# Altium schematic sheet Sheet_ConnectA10.SchDoc: Sheet_ConnectA10
size A4; Organization: Altium Limited; Address1: L3, 12a Rodborough Rd; Address2: Frenchs Forest; Address3: NSW; Address4: Australia 2086
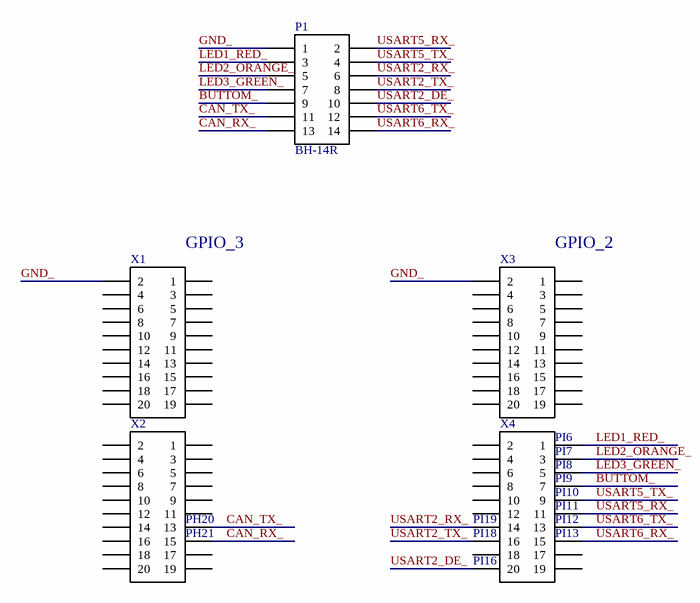
[diagram p0: Sheet_ConnectA10.SchDoc]

## Parts
P1  BH-14R  [BH-14R]
X1  PBD2-20  [PBD2-1.27-20-SMD]  (value not drawn)
X2  PBD2-20  [PBD2-1.27-20-SMD]  (value not drawn)
X3  PBD2-20  [PBD2-1.27-20-SMD]  (value not drawn)
X4  PBD2-20  [PBD2-1.27-20-SMD]  (value not drawn)

## Nets
BUTTOM_: P1.9 X4.7
CAN_RX_: P1.13 X2.15
CAN_TX_: P1.11 X2.13
GND_: P1.1 X1.2 X3.2
LED1_RED_: P1.3 X4.1
LED2_ORANGE_: P1.5 X4.3
LED3_GREEN_: P1.7 X4.5
USART2_DE_: P1.10 X4.20
USART2_RX_: P1.6 X4.14
USART2_TX_: P1.8 X4.16
USART5_RX_: P1.2 X4.11
USART5_TX_: P1.4 X4.9
USART6_RX_: P1.14 X4.15
USART6_TX_: P1.12 X4.13

Not connected (* = marked no-connect by the designer): X1 1 3 4 5 6 7 8 9 10 11 12 13 14 15 16 17 18 19 20; X2 1 2 3 4 5 6 7 8 9 10 11 12 14 16 17 18 19 20; X3 1 3 4 5 6 7 8 9 10 11 12 13 14 15 16 17 18 19 20; X4 2 4 6 8 10 12 17 18 19

## Notes on the sheet
- (near X1) GPIO_3
- (near X3) GPIO_2
- (near X4) PI6
- (near X4) PI7
- (near X4) PI8
- (near X4) PI10
- (near X4) PI11
- (near X4) PI9
- (near X2) PH20
- (near X2) PH21
- (near X4) PI16
- (near X4) PI18
- (near X4) PI19
- (near X4) PI12
- (near X4) PI13
- Title
- Size:
- Date:
- A4
- Number:
- Time:
- Revision:
- Sheet
- of
- File:

## Library data of the parts
P1 = BH-14: IDC/BH; LatestRevisionDate: 17-Jul-2002; LatestRevisionNote: Re-released for DXP Platform.; Publisher: Altium Limited
X1-X4 = PBD2-20: Header, 20-Pin